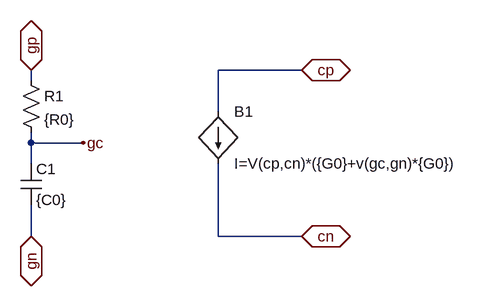
[diagram p0: schematic GP_Capteur_Graphite.asc]
GP_Capteur_Graphite.asc, the LTspice schematic file:
Version 4
SHEET 1 880 680
WIRE 480 16 352 16
WIRE 64 32 64 16
WIRE 352 80 352 16
WIRE 64 128 64 112
WIRE 144 128 64 128
WIRE 64 160 64 128
WIRE 64 272 64 224
WIRE 352 272 352 160
WIRE 480 272 352 272
FLAG 64 16 gp
IOPIN 64 16 BiDir
FLAG 64 272 gn
IOPIN 64 272 BiDir
FLAG 144 128 gc
FLAG 480 16 cp
IOPIN 480 16 BiDir
FLAG 480 272 cn
IOPIN 480 272 BiDir
SYMBOL res 48 16 R0
SYMATTR InstName R1
SYMATTR Value {R0}
SYMBOL cap 48 160 R0
SYMATTR InstName C1
SYMATTR Value {C0}
SYMBOL bi 352 80 R0
SYMATTR InstName B1
SYMATTR Value I=V(cp,cn)*({G0}+v(gc,gn)*{G0})

The netlist it stands for:
* GP_Capteur_Graphite.asc
R1 gp gc {R0}
C1 gc gn {C0}
B1 cp cn I=V(cp,cn)*({G0}+v(gc,gn)*{G0})
.backanno
.end